# Altium schematic sheet CATS-EUROC-Baro.SchDoc: CATS EuRoC Edition
size A4; DocumentNumber: Overview; Revision: V1.0; SheetNumber: 7; SheetTotal: 16; Author: Luca Jost; Subtitle: Barometer
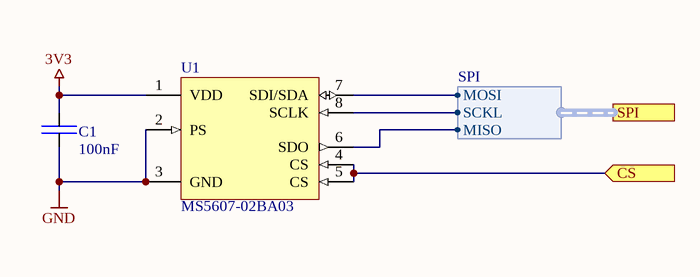
[diagram p0: CATS-EUROC-Baro.SchDoc]

## Parts
C1  100nF  [SMD Keramikkondensator 0402]
U1  MS5607-02BA03  [SMD IC BARO MS5607]

## Ports
CS (in), SPI (harness SPI)

## Harnesses
SPI: SCKL, MOSI, MISO

## Nets
3V3: C1.2 U1.1(VDD)
GND: C1.1 U1.2(PS) U1.3(GND)
CS: U1.4(CS) U1.5(CS) ; port CS
NetU1_6: U1.6(SDO) ; port SPI.MISO
NetU1_7: U1.7(SDI/SDA) ; port SPI.MOSI
NetU1_8: U1.8(SCLK) ; port SPI.SCKL

## Notes on the sheet
- Title
- Author:
- Subtitle
- Date:
- Rev:
- File:
- Sheet
- of

## Library data of the parts
C1 = E6 - 100nF: SMD Ceramic Capacitor E6; Unit Price: 0.01; Number: -; Supplier: -; JLC: C307331
U1 = MS5607-02BA03: Barometric Pressure Sensor, with stainless / steel cap; ComponentLink1Description: Datasheet; ComponentLink1URL: https://www.te.com/commerce/DocumentDelivery/DDEController?Action=srchrtrv&DocNm=MS5607-02BA03&DocType=Data+Sheet&DocLang=English; Digikey: 223-1198-1-ND